# EAGLE design Pyr0-Piezo-Standalone_3.0.0 (EAGLE 9.3.0)
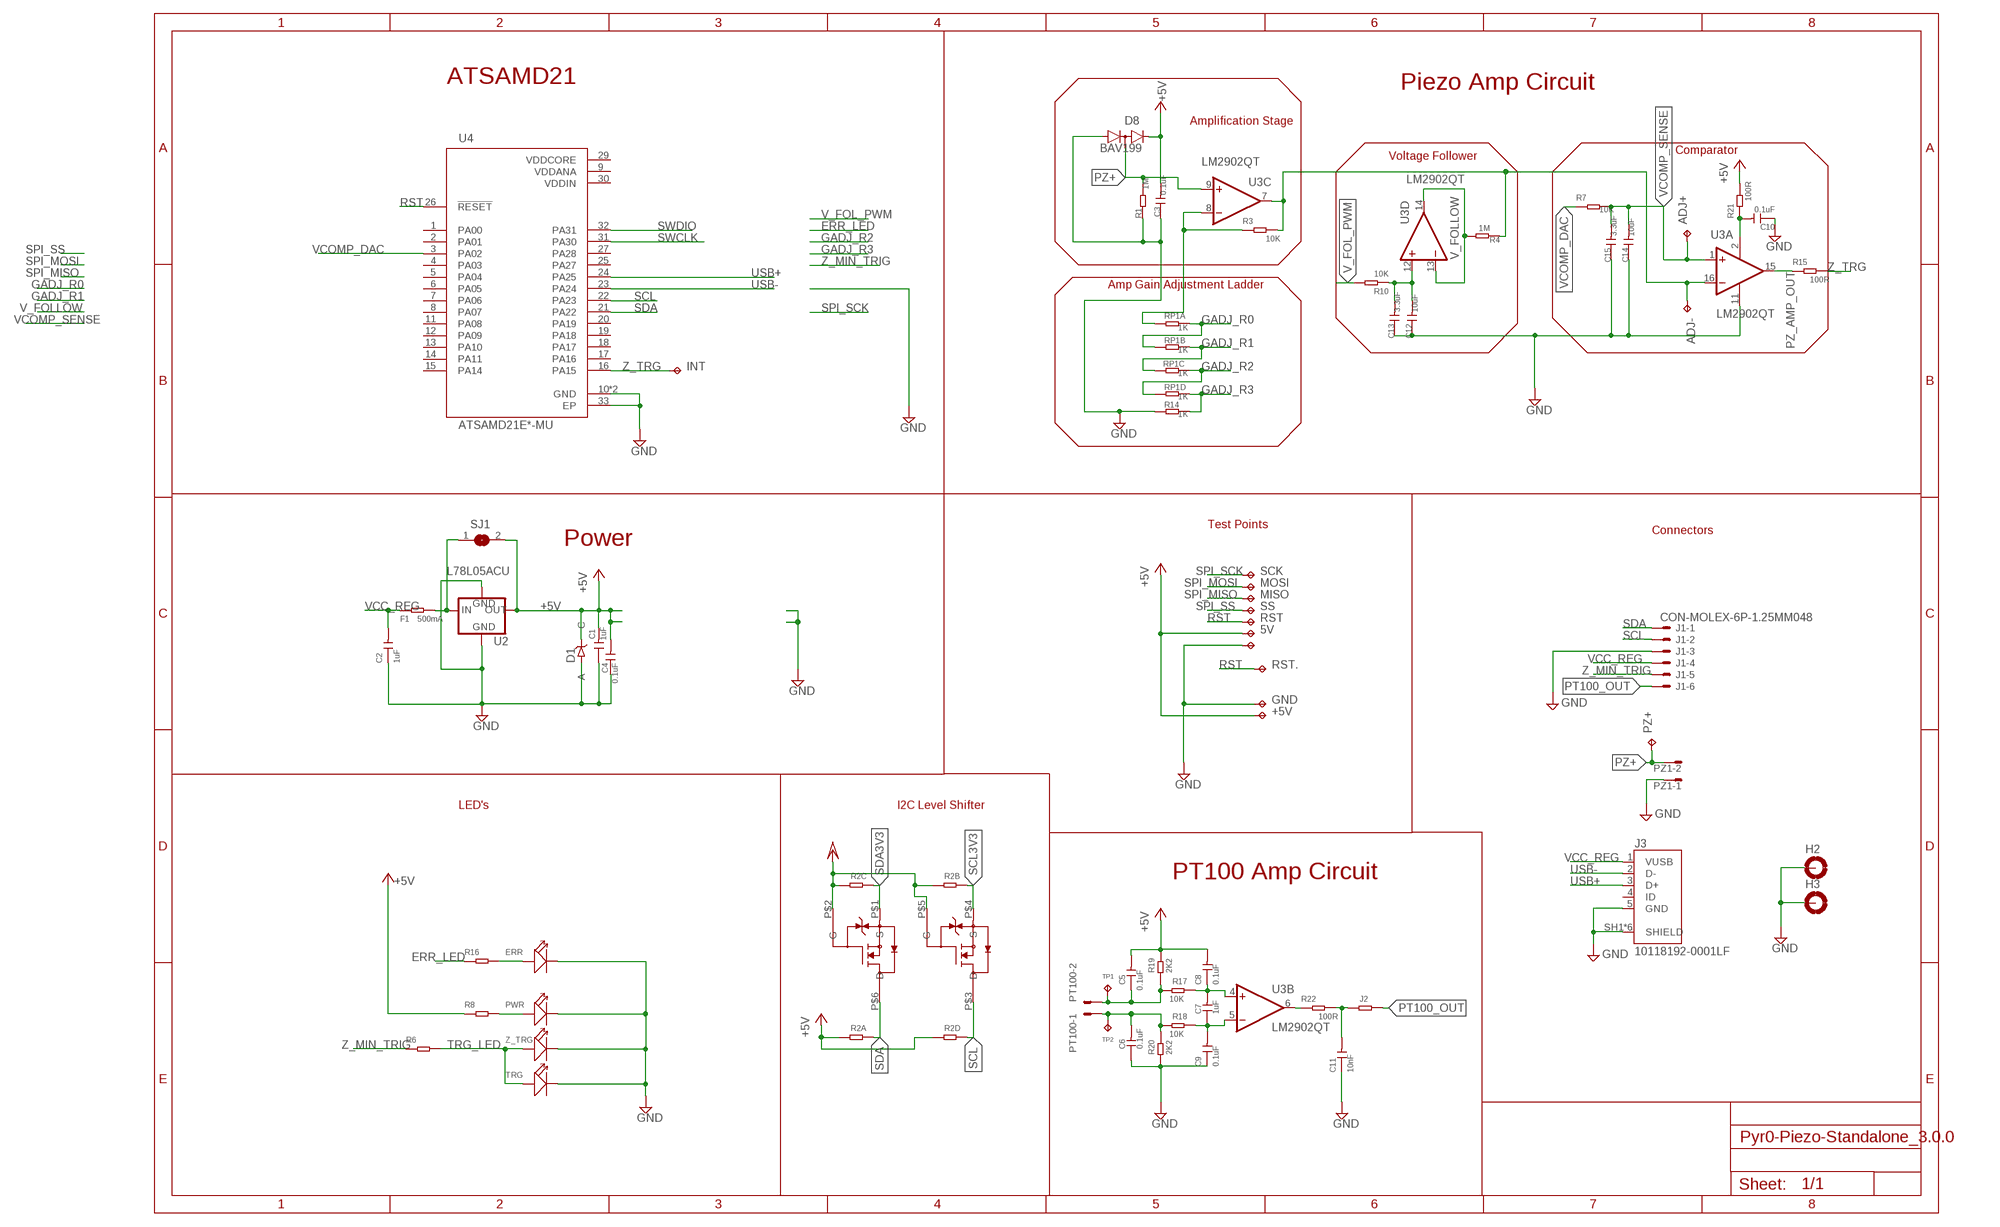
[diagram p0: schematic, sheet 1]

## Parts
5V  TPTP13SQ  [TP13SQ]
+5V  TPTP13SQ  [TP13SQ]
ADJ+  TPTP13SQ  [TP13SQ]
ADJ-  TPTP13SQ  [TP13SQ]
C1  1uF  SEEED-CAPACITOR_CERAMIC-10UF-25V-10%-X5R(0805)CAP_0603_GEN  [CAPC1609X80]
C2  1uF  SEEED-CAPACITOR_CERAMIC-10UF-25V-10%-X5R(0805)CAP_0603_GEN  [CAPC1609X80]
C3  0.1uF  CERAMIC-1NF-50V-10%-X7R(0402)CAP_0402  [CAPC1005X50]
C4  0.1uF  CERAMIC-1NF-50V-10%-X7R(0402)CAP_0402  [CAPC1005X50]
C5  0.1uF  CERAMIC-1NF-50V-10%-X7R(0402)CAP_0402  [CAPC1005X50]
C6  0.1uF  CERAMIC-1NF-50V-10%-X7R(0402)CAP_0402  [CAPC1005X50]
C7  1uF  CERAMIC-1NF-50V-10%-X7R(0402)CAP_0402  [CAPC1005X50]
C8  0.1uF  CERAMIC-1NF-50V-10%-X7R(0402)CAP_0402  [CAPC1005X50]
C9  0.1uF  CERAMIC-1NF-50V-10%-X7R(0402)CAP_0402  [CAPC1005X50]
C10  0.1uF  CERAMIC-1NF-50V-10%-X7R(0402)CAP_0402  [CAPC1005X50]
C11  10nF  CERAMIC-1NF-50V-10%-X7R(0402)CAP_0402  [CAPC1005X50]
C12  10uF  CERAMIC-1NF-50V-10%-X7R(0402)CAP_0402  [CAPC1005X50]
C13  3.3uF  CERAMIC-1NF-50V-10%-X7R(0402)CAP_0402  [CAPC1005X50]
C14  10uF  CERAMIC-1NF-50V-10%-X7R(0402)CAP_0402  [CAPC1005X50]
C15  3.3uF  CERAMIC-1NF-50V-10%-X7R(0402)CAP_0402  [CAPC1005X50]
D1  ZENER_DIODE_PLZ5V1C  [DO-219AC]
D8  BAV199  [SOT23]
ERR  SEEED-LED_SMD-LED-CLEAR-BLUE(0603)LED_0603  [SEEED-LED_LED-0603]
F1  500mA  SMD-RES-0R-5%-1/16W(0402)  [R0402]
GND  TPTP13SQ  [TP13SQ]
H2  HOLES_MOUNT-PAD-ROUND2.8  [HOLES_2,8-PAD]
H3  HOLES_MOUNT-PAD-ROUND2.8  [HOLES_2,8-PAD]
INT  TPTP06R  [TP06R]
J1  CON-MOLEX-6P-1.25MM048  [53048-06]
J2  SEEED-RESISTOR_SMD-RES-1.5K-1%-1/10W(0603)DETAILED_MODEL  [SEEED-RESISTOR_R0603]
J3  10118192-0001LF  [AMPHENOL_10118192-0001LF]
MISO  TPTP13SQ  [TP13SQ]
MOSI  TPTP13SQ  [TP13SQ]
PT100  CON-MOLEX-2P-1.27MM048  [53048-02]
PWR  SEEED-LED_SMD-LED-CLEAR-BLUE(0603)LED_0603  [SEEED-LED_LED-0603]
PZ1  CON-MOLEX-2P-1.27MM048  [53048-02]
PZ+  TPTP13SQ  [TP13SQ]
R1  1M  SMD-RES-0R-5%-1/16W(0402)  [R0402]
R2  RESISTOR_NETWORK_X40804_L  [EXBN8V-L]
R3  10K  SMD-RES-0R-5%-1/16W(0402)  [R0402]
R4  1M  SMD-RES-0R-5%-1/16W(0402)  [R0402]
R6  SMD-RES-0R-5%-1/16W(0402)  [R0402]
R7  10K  SMD-RES-0R-5%-1/16W(0402)  [R0402]
R8  SMD-RES-0R-5%-1/16W(0402)  [R0402]
R10  10K  SMD-RES-0R-5%-1/16W(0402)  [R0402]
R14  1K  SMD-RES-0R-5%-1/16W(0402)  [R0402]
R15  100R  SMD-RES-0R-5%-1/16W(0402)  [R0402]
R16  SMD-RES-0R-5%-1/16W(0402)  [R0402]
R17  10K  SMD-RES-0R-5%-1/16W(0402)  [R0402]
R18  10K  SMD-RES-0R-5%-1/16W(0402)  [R0402]
R19  2K2  SMD-RES-0R-5%-1/16W(0402)  [R0402]
R20  2K2  SMD-RES-0R-5%-1/16W(0402)  [R0402]
R21  100R  SMD-RES-0R-5%-1/16W(0402)  [R0402]
R22  100R  SMD-RES-0R-5%-1/16W(0402)  [R0402]
RP1  1K  RESISTOR_NETWORK_X40804_L  [EXBN8V-L]
RST  TPTP13SQ  [TP13SQ]
RST.  TPTP13SQ  [TP13SQ]
SCK  TPTP13SQ  [TP13SQ]
SJ1  SJM  [SJM]
SS  TPTP06R  [TP06R]
TP1  TPTP09R  [TP09R]
TP2  TPTP09R  [TP09R]
TRG  SEEED-LED_SMD-LED-CLEAR-BLUE(0603)LED_0603  [SEEED-LED_LED-0603]
U2  L78L05ACU  [SOT89]
U3  LM2902QT  [QFN16]
U4  ATSAMD21E*-MU  [QFN50P500X500X100-33N]
U$3  MOSFET_ARRAY_EMK34  [SOT-563]
Z_TRG  SEEED-LED_SMD-LED-CLEAR-BLUE(0603)LED_0603  [SEEED-LED_LED-0603]
⏚  TPTP13SQ  [TP13SQ]

## Nets
+3.3V: R2.6 R2.7 U$3.P$2(G) U$3.P$5(G)
+5V: 5V.TP +5V.TP C1.2 C3.2 C4.2 C5.2 C8.2 D1.P$2(C) D8.2(C) R2.5 R2.8 R8.1 R19.2 R21.2 SJ1.2 U2.1(OUT)
AMP_VCC: C10.2 R21.1 U3.2(P:V+)
ERR_LED: R16.1
ERR_LED)R: ERR.+ R16.2
GADJ_R0: RP1.2 RP1.8
GADJ_R1: RP1.3 RP1.7
GADJ_R2: RP1.4 RP1.6
GADJ_R3: R14.2 RP1.5
GAIN_ADJ: R3.1 RP1.1 U3.8(C:-IN)
GAIN_OUT: ADJ-.TP R3.2 R4.1 U3.7(C:OUT) U3.16(A:-IN)
GND: C1.1 C2.1 C3.1 C4.1 C6.1 C9.1 C10.1 C11.1 C12.1 C13.1 C14.1 C15.1 D1.P$1(A) D8.1(A) ERR.- GND.TP H2.B2,8(MOUNT) H3.B2,8(MOUNT) J1.3 J3.5(GND) J3.SH1(SHIELD) J3.SH2(SHIELD) J3.SH3(SHIELD) J3.SH4(SHIELD) J3.SH5(SHIELD) J3.SH6(SHIELD) PWR.- PZ1.1 R1.1 R14.1 R20.1 TRG.- U2.2(GND) U2.PAD U3.11(P:V-) U4.10(GND) U4.28(GND) U4.33(EP) Z_TRG.- ⏚.TP
PT100_JUMP: C11.2 J2.1 R22.2
PT100_OUT: J1.6 J2.2
PT_AMP: R22.1 U3.6(B:OUT)
PT_AMP+: C7.2 C8.1 R17.2 U3.4(B:+IN)
PT_AMP-: C7.1 C9.2 R18.2 U3.5(B:-IN)
PT_IN+: C5.1 PT100.2 R17.1 R19.1 TP1.TP
PT_IN-: C6.2 PT100.1 R18.1 R20.2 TP2.TP
PWR_LED: PWR.+ R8.2
PZ+: D8.3(AC) PZ1.2 PZ+.TP R1.2 U3.9(C:+IN)
PZ_AMP_OUT: R15.1 U3.15(A:OUT)
RST: RST..TP RST.TP U4.26(!RESET)
SCL: J1.2 R2.4 U4.22(PA23) U$3.P$3(D)
SCL3V3: R2.2 U$3.P$4(S)
SDA: J1.1 R2.1 U4.21(PA22) U$3.P$6(D)
SDA3V3: R2.3 U$3.P$1(S)
SPI_MISO: MISO.TP
SPI_MOSI: MOSI.TP
SPI_SCK: SCK.TP
SPI_SS: SS.TP
SWCLK: U4.31(PA30)
SWDIO: U4.32(PA31)
TRG_LED: R6.2 TRG.+ Z_TRG.+
USB+: J3.3(D+) U4.24(PA25)
USB-: J3.2(D-) U4.23(PA24)
V_FOL_ADJ: C12.2 C13.2 R10.1 U3.12(D:+IN)
V_FOL_PWM: R10.2
V_FOLLOW: R4.2 U3.13(D:-IN) U3.14(D:OUT)
VCC_FUSE: F1.2 SJ1.1 U2.3(IN)
VCC_REG: C2.2 F1.1 J1.4 J3.1(VUSB)
VCOMP_DAC: R7.1 U4.3(PA02)
VCOMP_SENSE: ADJ+.TP C14.2 C15.2 R7.2 U3.1(A:+IN)
Z_MIN_TRIG: J1.5 R6.1
Z_TRG: INT.TP R15.2 U4.16(PA15)
Unconnected: J3.4(ID) U4.1(PA00) U4.2(PA01) U4.4(PA03) U4.5(PA04) U4.6(PA05) U4.7(PA06) U4.8(PA07) U4.11(PA08) U4.12(PA09) U4.13(PA10) U4.14(PA11) U4.15(PA14) U4.17(PA16) U4.18(PA17) U4.19(PA18) U4.20(PA19) U4.25(PA27) U4.27(PA28)

## Notes on the sheet
- ATSAMD21 | Piezo Amp Circuit
- Amplification Stage
- Comparator
- Voltage Follower
- Amp Gain Adjustment Ladder
- Test Points
- Connectors
- Power
- LED's | I2C Level Shifter
- PT100 Amp Circuit

## Power pins joined to a net without a drawn wire
VDDANA: U4.9(VDDANA)
VDDCORE: U4.29(VDDCORE)
VDDIN: U4.30(VDDIN)

## Library data of the parts
5V ADJ+ ADJ- MISO MOSI PZ+ RST SCK TP1 TP2 = PiezoFFC:TP: Test pad
+5V GND INT RST. SS ⏚ = testpad:TP: Test pad
C1 C2 = PiezoFFC:SEEED-CAPACITOR_CERAMIC-10UF-25V-10%-X5R(0805): 302010178
C3-C15 = PiezoFFC:CERAMIC-1NF-50V-10%-X7R(0402): 302010005
D1 = PiezoFFC:ZENER_DIODE_PLZ5V1C
D8 = PiezoFFC:BAV199: DIODE low-leakage double diode
ERR PWR TRG Z_TRG = PiezoFFC:SEEED-LED_SMD-LED-CLEAR-BLUE(0603): 304090045
F1 R1 R3 R4 R6-R8 R10 R14-R22 = PiezoFFC:SMD-RES-0R-5%-1/16W(0402): 301010000; MPN: RC0402JR-070RL; VALUE: 0R
H2 H3 = PiezoFFC:HOLES_MOUNT-PAD-ROUND: MOUNTING PAD, round
J1 = PiezoFFC:CON-MOLEX-6P-1.25MM: CONNECTOR wire to board 1.25 mm (.049 inch) pitch header; MF: WALDOM/MOLEX; MPN: 53048-0610; OC_FARNELL: 1012260; OC_NEWARK: 38C9911
J2 = PiezoFFC:SEEED-RESISTOR_SMD-RES-1.5K-1%-1/10W(0603): 301010189
J3 = PiezoFFC:10118192-0001LF: Single Port 5 Contact Horizontal Right Angle Shielded Micro B USB 2.0 Connector; DESCRIPTION: Conn Micro USB Type B RCP 5 POS 0.65mm Solder RA SMD 5 Terminal 1 Port T/R; DIGI-KEY_PART_NUMBER: 609-4613-1-ND; DIGI-KEY_PURCHASE_URL: https://www.digikey.com/product-detail/en/amphenol-fci/10118192-0001LF/609-4613-1-ND/2785378?utm_source=snapeda&utm_medium=aggregator&utm_campaign=symbol; MF: Amphenol FCI; MP: 10118192-0001LF; PACKAGE: None
PT100 PZ1 = PiezoFFC:CON-MOLEX-2P-1.27MM: CONNECTOR wire to board 1.25 mm (.049 inch) pitch header; MF: MOLEX; MPN: 53048-0210; OC_FARNELL: 1012259; OC_NEWARK: 57H4718
R2 RP1 = PiezoFFC:RESISTOR_NETWORK_X4
SJ1 = PiezoFFC:SJ: SMD solder JUMPER
U2 = PiezoFFC:L78L05ACU: 5V Positive voltage regulator SMD SOT89 Package; AVAILABILITY: Unavailable; DESCRIPTION: Voltage regulator; fixed; 5V; 0.1A; SOT89; SMD; Package: reel, tape; MF: STMicroelectronics; MP: L78L05ACU-TR; PACKAGE: None; PRICE: None
U3 = PiezoFFC:LM2902: Low power quad operational amplifier Source: Data sgeet <http://www.st.com/internet/com/TECHNICAL_RESOURCES/TECHNICAL_LITERATURE/DATASHEET/CD00000533.pdf>
U4 = PiezoFFC:ATSAMD21: SAMD21E Series 256 KB Flash 32 KB SRAM 48 MHz 32-Bit Microcontroller - QFN-32; AVAILABILITY: Unavailable; DESCRIPTION: SAMD21E Series 256 KB Flash 32 KB SRAM 48 MHz 32-Bit Microcontroller - QFN-32; MF: Microchip; MP: ATSAMD21E18A-MU; PACKAGE: QFN-32 Microchip; PRICE: None
U$3 = PiezoFFC:MOSFET_ARRAY_EMK34

## Board
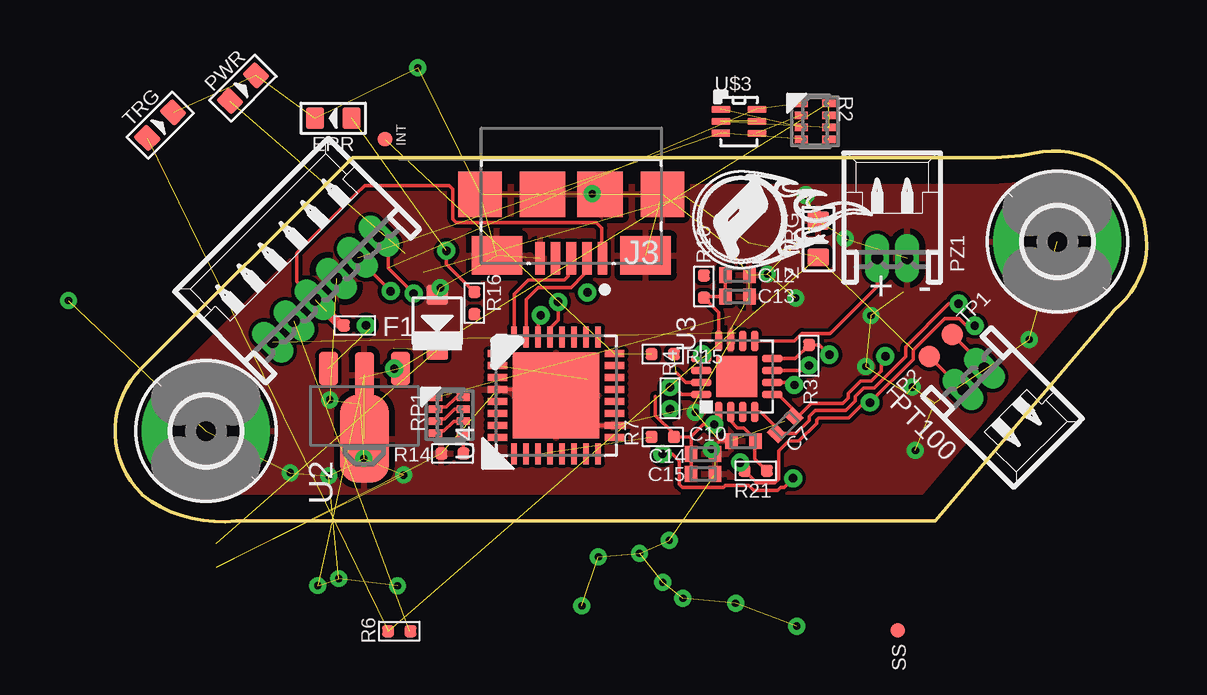
[diagram p1: board, top side]
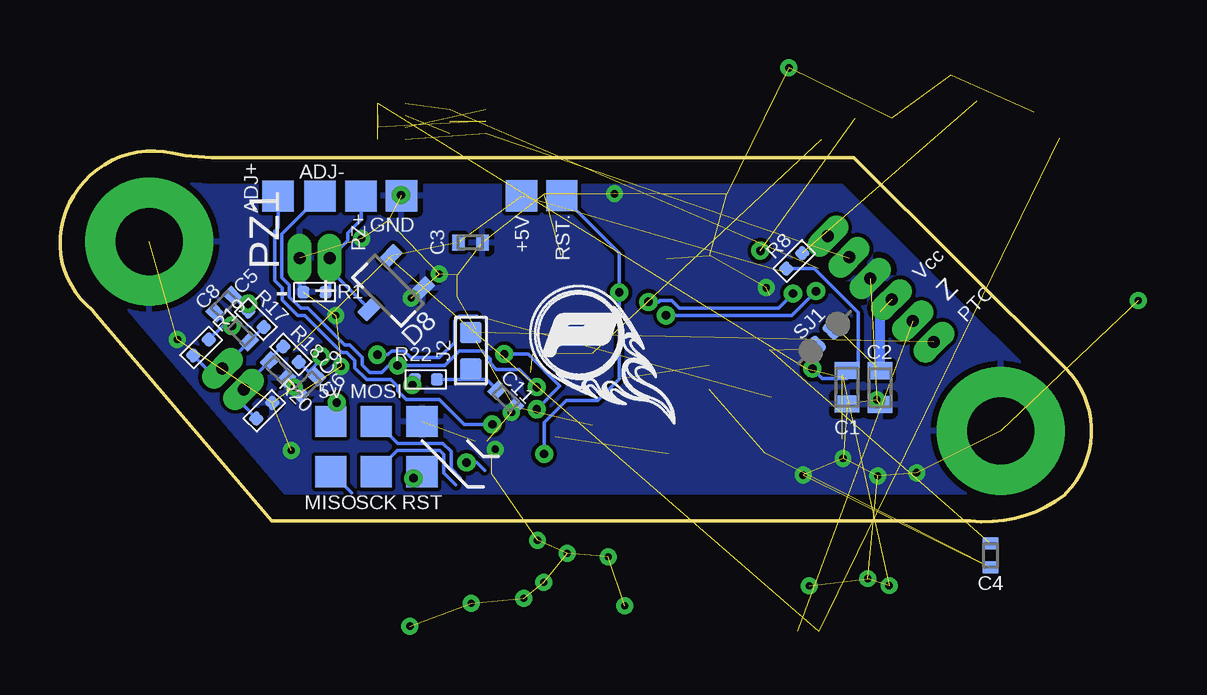
[diagram p2: board, bottom side, seen from below]

Size 42.98 x 15.45 mm. Coordinates in mm from the lower left corner, seen from the top.
Outline: 1.07,6.39 arc90 1.07,1.18 1.12,1.12 arc45 5.05,0.04 34.16,0.04 41.48,8.63 41.63,8.82 arc35 42.89,10.76 arc114 38.28,15.37 arc-12 36.67,15.19 9.91,15.19 1.07,6.39
Copper layers (1*16): Top 0.035mm / dielectric 1.5mm / Bottom 0.035mm
Design rules "default *": minimum track width 6mil, minimum drill 0.35mm, track to track 6mil, track to pad 6mil, pad to pad 6mil, via to via 6mil, smd to smd 6mil, copper to edge 40mil, drill to drill 6mil, minimum pad ring 10mil, minimum via ring 8mil, stop-mask expansion 4mil, vias tented up to drill 4mm, thermal gap 10mil

### Footprints (pad centres in the part's own frame; a part is rotated, then mirrored left to right if it is on the bottom)
TP13SQ = smd 1.3 x 1.3: TP 0,0
CAPC1609X80 = smd 0.712 x 1.012: 1 -0.7,0; 2 0.7,0
CAPC1005X50 = smd 0.512 x 0.662: 1 -0.5,0; 2 0.5,0
DO-219AC = smd 0.8 x 0.9: P$1 -1.15,0; P$2 1.15,0
SOT23 = smd 0.6 x 0.9: 1 -0.95,-1.1; 2 0.95,-1.1; 3 0,1.1
SEEED-LED_LED-0603 = smd 0.762 x 0.889: + -0.762,0; - 0.762,0
R0402 = smd 0.5 x 0.5: 1 0,0.463; 2 0,-0.463
HOLES_2,8-PAD = drill 2.8 pad 5.334: B2,8 0,0
TP06R = smd 0.6 x 0.6: TP 0,0
53048-06 = drill 0.5 pad 0.698 long: 1 3.125,-1.25; 2 1.875,-1.25; 3 0.625,-1.25; 4 -0.625,-1.25; 5 -1.875,-1.25; 6 -3.125,-1.25
SEEED-RESISTOR_R0603 = smd 0.889 x 0.889: 1 0,0.762; 2 0,-0.762
AMPHENOL_10118192-0001LF = smd 0.4 x 1.35: 1 -1.3,0; 2 -0.65,0; 3 0,0; 4 0.65,0; 5 1.3,0 | smd 2.1 x 1.6: SH1 -3.1,-0.125; SH2 3.1,-0.125 | smd 1.8 x 1.9: SH3 -3.8,-2.675; SH6 3.8,-2.675 | smd 1.9 x 1.9: SH4 -1.2,-2.675; SH5 1.2,-2.675
53048-02 = drill 0.5 pad 0.698 long: 1 0.625,-1.25; 2 -0.625,-1.25
EXBN8V-L = smd 0.556 x 0.3: 1 -0.578,0.75; 2 -0.578,0.25; 3 -0.578,-0.25; 4 -0.578,-0.75; 5 0.578,-0.75; 6 0.578,-0.25; 7 0.578,0.25; 8 0.578,0.75
SJM = smd 0.65 x 0.75: 1 -0.508,0; 2 0.508,0
TP09R = smd 0.9 x 0.9: TP 0,0
SOT89 = smd 0.8 x 1.4: 1 -1.499,-1.981; 3 1.499,-1.981 | smd 0.8 x 1.9: 2 0,-1.727 | smd 2.032 x 3.65: PAD 0,0.94
QFN16 = smd 0.85 x 0.3: 1 -1.475,0.75; 2 -1.475,0.25; 3 -1.475,-0.25; 4 -1.475,-0.75; 9 1.475,-0.75; 10 1.475,-0.25; 11 1.475,0.25; 12 1.475,0.75 | smd 0.3 x 0.85: 5 -0.75,-1.475; 6 -0.25,-1.475; 7 0.25,-1.475; 8 0.75,-1.475; 13 0.75,1.475; 14 0.25,1.475; 15 -0.25,1.475; 16 -0.75,1.475 | smd 1.7 x 1.7: TH 0,0
QFN50P500X500X100-33N = smd 0.84 x 0.26: 1 -2.435,1.75; 2 -2.435,1.25; 3 -2.435,0.75; 4 -2.435,0.25; 5 -2.435,-0.25; 6 -2.435,-0.75; 7 -2.435,-1.25; 8 -2.435,-1.75; 17 2.435,-1.75; 18 2.435,-1.25; 19 2.435,-0.75; 20 2.435,-0.25; 21 2.435,0.25; 22 2.435,0.75; 23 2.435,1.25; 24 2.435,1.75 | smd 0.26 x 0.84: 9 -1.75,-2.435; 10 -1.25,-2.435; 11 -0.75,-2.435; 12 -0.25,-2.435; 13 0.25,-2.435; 14 0.75,-2.435; 15 1.25,-2.435; 16 1.75,-2.435; 25 1.75,2.435; 26 1.25,2.435; 27 0.75,2.435; 28 0.25,2.435; 29 -0.25,2.435; 30 -0.75,2.435; 31 -1.25,2.435; 32 -1.75,2.435 | smd 3.6 x 3.6: 33 0,0
SOT-563 = smd 0.8 x 0.3: P$1 -0.75,0.5; P$2 -0.75,0; P$3 -0.75,-0.5; P$4 0.75,-0.5; P$5 0.75,0; P$6 0.75,0.5

### Placement (x,y rotation side)
5V  31.7,4.18 270 bottom
+5V  23.75,13.58 90 bottom
ADJ+  33.89,13.58 90 bottom
ADJ-  32.15,13.58 0 bottom
C1  10.19,5.6 90 bottom
C2  8.81,5.59 90 bottom
C3  25.88,11.64 180 bottom
C4  4.21,-1.41 90 bottom
C5  35.45,7.86 135 bottom
C6  33.89,6.34 135 bottom
C7  27.92,4.02 225 top
C8  36.15,9.07 225 bottom
C9  32.66,5.7 45 bottom
C10  26.18,3.36 0 top
C11  24.4,5.13 135 bottom
C12  25.92,10.28 180 top
C13  25.92,9.39 180 top
C14  24.5,2.82 180 top
C15  24.5,1.99 180 top
D1  13.41,8.31 270 top
D8  29.31,9.63 135 bottom
ERR  9.09,16.82 180 top
F1  9.99,8.18 90 top
GND  28.75,13.59 270 bottom
H2  3.78,3.78 45 top
H3  39.26,11.67 45 top
INT  11.24,15.95 0 top
J1  7.89,10.58 45 top
J2  25.86,7.13 180 bottom
J3  19,10.98 180 top
MISO  31.7,2.09 270 bottom
MOSI  29.8,4.18 0 bottom
PT100  36.66,5.07 225 top
PWR  5.32,18.07 45 top
PZ1  32.37,12.24 0 top
PZ+  30.43,13.58 0 bottom
R1  32.37,9.57 90 bottom
R2  29.16,16.69 0 top
R3  28.91,6.91 0 top
R4  23.12,5.15 0 top
R6  11.84,-4.57 270 top  (outside the outline)
R7  22.81,3.53 90 top
R8  12.39,10.87 135 bottom
R10  24.53,9.8 180 top
R14  14.05,2.84 90 top
R15  22.81,6.99 270 top
R16  14.97,9.12 180 top
R17  34.81,8.44 225 bottom
R18  33.35,6.97 45 bottom
R19  37.1,7.26 135 bottom
R20  34.46,4.63 315 bottom
R21  26.69,2.12 270 top
R22  27.73,5.93 90 bottom
RP1  13.92,4.43 0 top
RST  27.89,2.09 90 bottom
RST.  22.08,13.59 270 bottom
SCK  29.8,2.09 0 bottom
SJ1  11.13,7.67 225 bottom
SS  32.6,-4.54 90 top  (outside the outline)
TP1  34.88,7.8 45 top
TP2  33.93,6.88 45 top
TRG  1.87,16.53 45 top
U2  10.38,4.4 180 top
U3  25.89,6.05 90 top
U4  18.37,5.26 90 top
U$1  [LOGO-PYR0BALL-SS-6MM]  22.81,5.26 0 bottom
U$2  [LOGO-PYR0BALL-SS-6MM]  26.88,9.77 45 top
U$3  25.99,16.69 0 top
Z_TRG  29.3,11.79 90 top
⏚  27.89,4.18 90 bottom

### Tracks (layer width: path | path; a pad name or v marks a point on that pad's centre or on a via)
+3.3V  (3 unrouted)
+5V  (via drill 0.35)  (9 unrouted)
  Top 0.152: v26.04,2.47 26.22,2.28 R21.2 26.73,1.61 27.48,1.61 27.64,1.77 27.64,2.95 28.06,3.36 28.49,3.36 29.23,4.1 29.23,4.24 29.3,4.32 30.56,4.32 31.2,4.96 v31.45,4.96 33.25,6.76 33.25,7.16 34.56,8.48 35.16,8.48 35.47,8.16 v35.82,8.16
  Bottom 0.152: 12.84,10.41 R8.1 11.55,10.54 9.73,8.72 9.73,6.42 10.19,5.96 | 10.19,5.96 C1.2 | v11.63,6.38 11.58,6.33 11.21,5.96 10.19,5.96 | 31.7,4.05 5V.TP 31.7,4.23 31.45,4.49 v31.45,4.96 | v35.82,8.16 35.8,8.16 | 35.73,8.29 C5.2 35.82,8.2 v35.82,8.16 | 25.29,2.14 25.62,2.47 v26.04,2.47 | C8.2 35.95,8.16 | 35.95,8.16 v35.82,8.16 | R19.2 36.2,8.16 35.95,8.16
  Bottom 0.406: SJ1.2 11.58,7.22 11.58,6.33
AMP_VCC
  Top 0.152: 25.66,4.57 U3.2 25.64,4.2 25.92,3.92 26.19,3.92 26.55,3.55 26.55,3.48 C10.2 26.65,3.32 26.65,2.62 R21.1
ERR_LED
  Top 0.152: R16.1 14.81,8.5
ERR_LED)R  (via drill 0.35)  (1 unrouted)
  Top 0.152: R16.2 13.8,10.75 v13.8,11.3
GADJ_R0
  Top 0.152: RP1.8 14.2,5.19 13.79,4.77 13.43,4.77 RP1.2
GADJ_R1
  Top 0.152: RP1.7 14.14,4.69 13.72,4.27 13.43,4.27 RP1.3
GADJ_R2
  Top 0.152: RP1.4 13.43,3.77 13.69,3.77 14.1,4.19 RP1.6
GADJ_R3
  Top 0.152: RP1.5 14.51,3.67 R14.2
GAIN_ADJ  (via drill 0.35)  (1 unrouted)
  Top 0.152: U3.8 28.34,6.8 R3.1 29.34,7.37 v29.75,6.96
  Bottom 0.152: v29.75,6.96 29.32,6.96 29.16,7.12 28.66,7.12 28.37,6.83 27.18,6.83 26.53,7.48 26.53,8.37 26.33,8.57 25.62,8.57
GAIN_OUT  (via drill 0.35)
  Top 0.152: R4.1 23.31,5.61 23.61,5.3 U3.16 | U3.7 28.76,6.3 R3.2 v28.91,6.51
  Bottom 0.152: v28.91,6.51 26.94,6.51 26.34,7.12 25.39,7.12 25.06,6.78 25.06,6.61 24.8,6.34 23.85,6.34 R4.1 | ADJ-.TP 33.73,11.99 33.73,10.18 33.42,9.87 33.42,9.37 32.95,8.9 32.65,8.9 31.11,7.36 30.9,7.36 30.38,6.84 30.38,6.54 30.07,6.23 29.57,6.23 29.28,6.51 v28.91,6.51 | v28.91,6.51
  other vias: 23.12,5.61
GND  (via drill 0.3, 0.35)  (65 unrouted)
  Top 0.152: 25.64,8.01 U3.11 | C10.1 25.18,3.36 v24.84,3.02 25,2.87 C14.1 | U4.28 18.12,5.51 U4.33 19.62,4.01 U4.10
  Bottom 0.152: R1.1 33,9.73 PZ1.1
  other vias: 23.66,-3.2 12.61,18.92 25.85,-3.41 31.49,8.6 -1.95,9.21 23.08,-0.78 33.34,2.97 38.08,7.6 20.13,-1.46 10.35,2.64 27.18,10.32 11.76,-2.68 13.55,9.75 12.02,1.94 19.87,13.67 28.4,-4.36 9.32,-2.38 8.43,-2.67 19.45,-3.51 22.82,-2.53 7.29,2.04 28.77,13.62 24.17,4.56 8.94,5.08 30.41,11.8 21.85,-1.33 8.9,1.91 31.27,6.47 28.35,9.33 33.22,5.61
  pour Top: 32.97,0.18 41.86,9.07 arc143 38.69,15.42 arc6 37.74,15.23 arc-13 36.85,15.1 9.92,15.1 9.8,14.98 1.22,6.4 arc133 3.7,0.12 32.91,0.12
  pour Bottom: 32.97,0.18 41.86,9.07 arc133 39.39,15.36 arc19 37.93,15.17 arc-22 36.72,15.04 9.99,15.04 9.92,14.98 1.29,6.34 arc134 3.76,0.18
PT100_JUMP
  Bottom 0.152: J2.1 26.31,5.93 R22.2 25.19,5.93 C11.2
PT100_OUT  (1 unrouted)
PT_AMP  (via drill 0.35)
  Top 0.152: U3.6 28.2,5.79 v28.3,5.7
  Bottom 0.152: v28.3,5.7 28.13,5.86 R22.1
PT_AMP+  (via drill 0.35)
  Top 0.152: U3.4 26.9,4.58 27.57,3.91 C7.2 28.36,3.67 28.92,4.23 28.92,4.38 29.16,4.63 30.43,4.63 30.84,5.03 30.84,5.21 31.2,5.57 31.62,5.57 32.94,6.89 32.94,7.29 34.74,9.09 v35.14,9.09
  Bottom 0.152: 35.73,9.36 C8.1 35.44,9.07 35.14,9.07 | R17.2 35.14,9.07 | R17.2 | v35.14,9.09 35.14,9.07
PT_AMP-  (via drill 0.35)
  Top 0.152: U3.5 27.62,5.3 28.41,4.51 | 28.41,4.51 28.5,4.43 29,4.93 30.31,4.93 30.54,5.16 30.54,5.34 31.07,5.88 31.5,5.88 31.91,6.29 31.91,6.72 v32.09,6.89 | 28.25,4.65 28.25,4.62 28.28,4.58 C7.1 28.41,4.51
  Bottom 0.152: R18.2 32.62,6.24 | 32.62,6.24 32.44,6.06 C9.2 | v32.09,6.89 32.09,6.78 32.62,6.24
PT_IN+
  Top 0.152: 34.88,7.73 TP1.TP 36.21,6.46 PT100.2
  Bottom 0.152: 34.52,8.08 34.58,8.08 34.58,8.03 R17.1 35.08,7.51 C5.1 PT100.2 36.89,6.4 R19.1
PT_IN-
  Top 0.152: PT100.1 35.29,5.51 TP2.TP
  Bottom 0.152: 34.25,6.58 C6.2 | R18.1 33.68,7.36 34.25,6.79 C6.2 | C6.2 35.33,5.61 PT100.1 35.33,4.84 R20.2
PWR_LED  (1 unrouted)
  Bottom 0.152: R8.2
PZ+
  Top 0.152: 26.72,7.6 U3.9 28.28,7.53 28.61,7.85 29.8,7.85 31.75,9.8 PZ1.2
  Bottom 0.152: 31.75,10.52 D8.3 | R1.2 31.75,9.73 31.75,10.52 | PZ1.2 31.75,10.98 | 31.75,10.98 31.75,10.52 | 31.75,10.98 31,11.73 31,12.04 30.43,12.6 PZ+.TP
PZ_AMP_OUT  (1 unrouted)
  Top 0.152: 24.05,5.8 U3.15 23.78,5.8 23.37,6.22
RST  (via drill 0.35)  (1 unrouted)
  Top 0.152: v28.25,1.81 27.87,1.43 27.73,1.43 27.61,1.3 26.61,1.3 26.4,1.51 25.43,1.51 25.35,1.43 23.62,1.43 23.5,1.55 23.5,2.54 23.22,2.82 v22.8,2.82
  Bottom 0.152: 22.13,13.54 RST..TP 19.67,11.19 v19.67,9.56 19.67,5.96 20.58,5.05 21.89,5.05 22.8,4.14 v22.8,2.82 | v28.25,1.81 27.97,2.09 RST.TP
SCL  (via drill 0.35)  (2 unrouted)
  Top 0.152: U4.22 17.62,8.49 v17.73,8.6 | v11.48,9.61 10.1,10.99 J1.2
  Bottom 0.152: v17.73,8.6 12.49,8.6 v11.48,9.61
SCL3V3  (1 unrouted)
SDA  (via drill 0.35)  (2 unrouted)
  Top 0.152: U4.21 18.13,7.71 18.13,8.08 18.46,8.4 v18.46,9.16 | v12.43,9.51 11.38,10.56 11.38,11.51 J1.1
  Bottom 0.152: v18.46,9.16 18.03,9.16 17.98,9.21 17.48,9.21 17.18,8.91 13.04,8.91 v12.43,9.51
SDA3V3  (1 unrouted)
SPI_MISO
  Bottom 0.152: 30.82,1.21 MISO.TP
SPI_MOSI
  Bottom 0.152: MOSI.TP 29.8,4.16 28.91,3.27 27.02,3.27 26.69,2.93 26.69,2.22 26.3,1.83
SPI_SCK
  Bottom 0.152: SCK.TP 28.92,2.96 27.15,2.96 26.99,2.81 26.99,2.03 26.49,1.53
SPI_SS
  Top 0.152: SS.TP 32.51,-4.45
TRG_LED  (2 unrouted)
USB+
  Top 0.152: J3.3 18.88,10.85 18.88,10.24 18.71,10.07 17.21,10.07 16.62,9.48 U4.24
USB-
  Top 0.152: J3.2 19.53,10.85 19.53,10.3 18.99,9.77 17.62,9.77 17.12,9.27 U4.23
V_FOL_ADJ
  Top 0.152: U3.12 25.14,8.72 R10.1 24.58,9.39 C13.2 C12.2
V_FOLLOW  (via drill 0.35)
  Top 0.152: v24.47,6.99 24.42,6.94 U3.13 U3.14
  Bottom 0.152: R4.2 22.15,5.66 23.47,6.99 v24.47,6.99
  other vias: 23.12,4.69
VCC_FUSE  (via drill 0.35)  (1 unrouted)
  Top 0.406: F1.2
  Bottom 0.406: SJ1.1 10.6,8.03 F1.2
  other vias: 10.45,8.18
VCC_REG  (2 unrouted)
  Top 0.152: J3.1 20.27,11.01 20.27,12.25 20.05,12.47 14.21,12.47 14.07,12.61 14.07,13.87 13.92,14.02 10.39,14.02 10,13.63 7.57,11.21 7.57,10.01 J1.4
  Top 0.406: 8.36,9.21 8.36,9.22 9.4,8.18 F1.1
  Bottom 0.406: C2.2 8.81,8.77
VCOMP_DAC  (1 unrouted)
VCOMP_SENSE  (via drill 0.35)
  Top 0.152: U3.1 25.14,4.12 25.08,4.05 v24.96,4.05 24.5,4.05 24,3.55 C14.2 | 22.51,5.22 22.51,4.44 23.27,3.67 R7.2 23.95,3.53 24,3.48 C14.2 | C15.2 C14.2
  Bottom 0.152: v24.96,4.05 26.14,4.05 27.18,5.09 28.55,5.09 28.9,5.45 28.9,5.64 29.19,5.92 30.19,5.92 30.69,6.41 30.69,6.71 31.03,7.05 31.24,7.05 32.78,8.59 33.07,8.59 33.72,9.24 33.72,9.75 34.03,10.06 34.03,12.12 33.89,12.26 ADJ+.TP
Z_MIN_TRIG  (1 unrouted)
  Top 0.152: R6.1 12.25,-4.57
Z_TRG  (2 unrouted)
  Top 0.152: 11.26,15.93 INT.TP

### Text on the board
tPlace: + -
bPlace: PZ1 | ⏚ | Z | Vcc | + - | PTC